# Altium schematic sheet Inputs and Relays.SchDoc
size A; DocumentNumber: 4; SheetNumber: 4; SheetTotal: 6
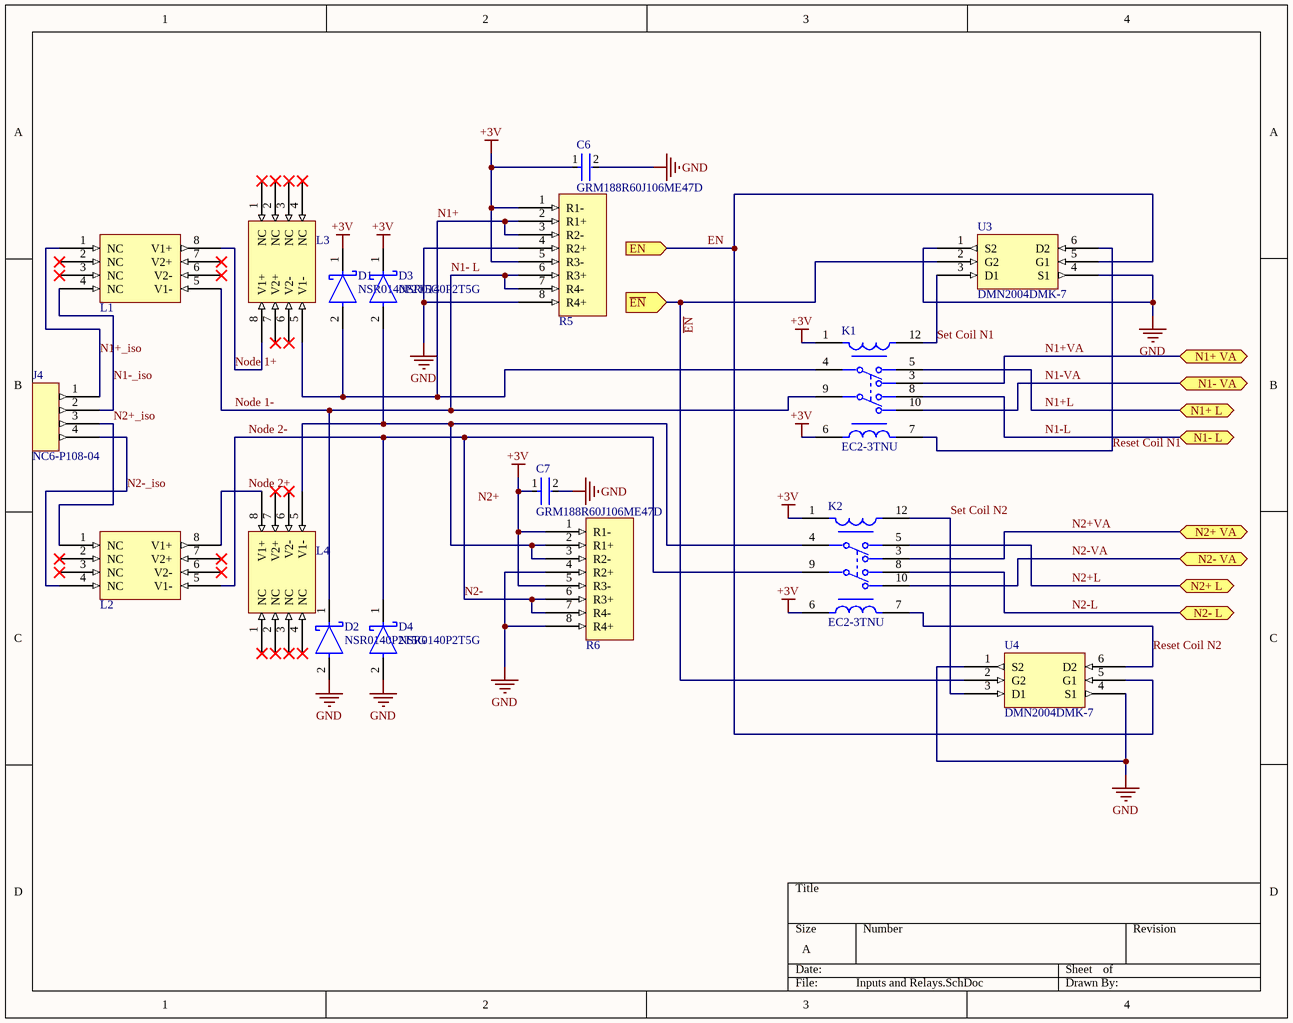
[diagram p0: Inputs and Relays.SchDoc]

## Parts
C6  GRM188R60J106ME47D  [FP-GRM188-0_1-e0_2_0_55-IPC_A]
C7  GRM188R60J106ME47D  [FP-GRM188-0_1-e0_2_0_55-IPC_A]
D1  NSR0140P2T5G  [FP-514AB-01-MFG]
D2  NSR0140P2T5G  [FP-514AB-01-MFG]
D3  NSR0140P2T5G  [FP-514AB-01-MFG]
D4  NSR0140P2T5G  [FP-514AB-01-MFG]
J4  NC6-P108-04  [NC6-P108-04-Footprint-1]
K1  EC2-3TNU  [FP-EC2-3TNU-MFG]
K2  EC2-3TNU  [FP-EC2-3TNU-MFG]
L1  RM6 Inductor  [RM6 Inductor-Footprint-1]  (value not drawn)
L2  RM6 Inductor  [RM6 Inductor-Footprint-1]  (value not drawn)
L3  RM6 Inductor  [RM6 Inductor-Footprint-1]  (value not drawn)
L4  RM6 Inductor  [RM6 Inductor-Footprint-1]  (value not drawn)
R5  4608X-102-205FLF  [4608X-102-205FLF-Footprint-1]  (value not drawn)
R6  4608X-102-205FLF  [4608X-102-205FLF-Footprint-1]  (value not drawn)
U3  DMN2004DMK-7  [SOT95P285X130-6N]
U4  DMN2004DMK-7  [SOT95P285X130-6N]

## Ports
EN (in), N1+ L (bidir), N1+ VA (bidir), N1- L (bidir), N1- VA (bidir), N2+ L (bidir), N2+ VA (bidir), N2- L (bidir), N2- VA (bidir), ~{EN} (in)

## Nets
+3V: C6.1 C7.1 D1.1(C) D3.1(C) K1.1(SET+) K1.6(RESET+) K2.1(SET+) K2.6(RESET+) R5.1(R1-) R5.5(R3-) R6.1(R1-) R6.5(R3-)
GND: C6.2 C7.2 D2.2(A) D4.2(A) R5.4(R2+) R5.8(R4+) R6.4(R2+) R6.8(R4+) U3.1(S2) U3.4(S1) U4.1(S2) U4.4(S1)
~{EN}: U3.2(G2) U4.2(G2) ; port ~{EN}
EN: U3.5(G1) U4.5(G1) ; port EN
N1+: D1.2(A) K1.4 L3.5(V1-) R5.2(R1+) R5.3(R2-)
N1+_iso: J4.1 L1.1(NC)
N1+L: K1.5 ; port N1+ L
N1+VA: K1.3 ; port N1+ VA
N1- L: D2.1(C) K1.9 L1.5(V1-) R5.6(R3+) R5.7(R4-)  [also labelled Node 1-]
N1-_iso: J4.2 L1.4(NC)
N1-L: K1.8 ; port N1- L
N1-VA: K1.10 ; port N1- VA
N2+_iso: J4.3 L2.1(NC)
N2+L: K2.5 ; port N2+ L
N2+VA: K2.3 ; port N2+ VA
N2-: D4.1(C) K2.9 L2.5(V1-) R6.6(R3+) R6.7(R4-)  [also labelled Node 2-]
N2-_iso: J4.4 L2.4(NC)
N2-L: K2.8 ; port N2- L
N2-VA: K2.10 ; port N2- VA
Node 1+: L1.8(V1+) L3.8(V1+)
Node 2+: L2.8(V1+) L4.8(V1+)
Reset Coil N1: K1.7(RESET-) U3.6(D2)
Reset Coil N2: K2.7(RESET-) U4.6(D2)
Set Coil N1: K1.12(SET-) U3.3(D1)
Set Coil N2: K2.12(SET-) U4.3(D1)
NetD3_2: D3.2(A) K2.4 L4.5(V1-) R6.2(R1+) R6.3(R2-)

Not connected (* = marked no-connect by the designer): L1 2(NC)* 3(NC)* 6(V2-)* 7(V2+)*; L2 2(NC)* 3(NC)* 6(V2-)* 7(V2+)*; L3 1(NC)* 2(NC)* 3(NC)* 4(NC)* 6(V2-)* 7(V2+)*; L4 1(NC)* 2(NC)* 3(NC)* 4(NC)* 6(V2-)* 7(V2+)*

## Notes on the sheet
- Labels drawn without touching a wire or pin: N2+

## Library data of the parts
C6 C7 = CMP-2006-02792-2: Chip Multilayer Ceramic Capacitors for General Purpose, 0603, 10uF, X5R, 15%, 20%, 6.3V; Packaging: Tape and Reel; Voltage Rating (DC): 6.3V; Width: 0.031inch; Termination: SMD/SMT; Dielectric: X5R; Package Quantity: 4000; Voltage Rating: 6.3V; Capacitance: 10uF; Case/Package: 0603; Min Operating Temperature: -55°C; Voltage: 6.3V; Length: 1.6mm; Thickness: 0.035inch; Lead Free: Lead Free; Depth: 0.8mm; Case Code (Imperial): 0603; Max Operating Temperature: 85°C; Material: Ceramic; Height: 0.8mm; Tolerance: 20%; Mount: Surface Mount; REACH SVHC: No SVHC; Radiation Hardening: No; Case Code (Metric): 1608
D1-D4 = CMP-1055-00493-2: DIODE SCHOTTKY 30V 70MA SOD923; Manufacturer: On Semiconductor; Max Surge Forward Current: 500mA; Capacitance: 2pF; Import Ts: 1521866362; Peak Reverse Current: 0.3uA; Ciiva Ids: 19354163; Max Repetitive Reverse Voltage: 40V; Max Junction Temp: +125°C; Value: 2pF; Automotive: No; ComponentLink2URL: http://www.onsemi.cn/pub_link/Collateral/NSR0140P2-D.PDF; Mouser Description: Schottky Diodes & Rectifiers SCHOTTKY DIODE; Height: 0.4mm; Temperature: -55°C to +125°C; Lead Free: Yes; Temperature Range Low: -55°C; Forward Current: 70mA; Device Class L2: Diodes; Reverse Voltage: 30V; Digikey Description: DIODE SCHOTTKY 30V 70MA SOD923; Temperature Range High: +125°C; Category: Diode; Octopart: https://octopart.com/nsr0140p2t5g-on+semiconductor-7506148; Device Class L1: Discrete Semiconductors; ComponentLink2Description: Datasheet; Package: 514AB-01; Device Class L3: Schottky Diodes; Release Date: 1407123163; Manufacturer Part Number: NSR0140P2T5G; RoHS: TRUE
J4 = CMP-002-00071-4: Conn Barrier Strip 4 POS 9.53mm Solder ST Thru-Hole 20A/Contact
K1 K2 = CMP-03195-000015-1: RELAY GEN PURPOSE DPDT 2A 3VDC; Relay Type: General Purpose; Release Time: 1ms; Number of Poles: 1; Power Consumption: 140mW; Coil Type: Latching, Dual Coil; Coil Resistance: 64.3R; Coil Voltage (DC): 3V; Coil Current: 46.7mA; Max Voltage Rating (AC): 250V; Max Voltage Rating (DC): 220V; Operate Time: 2ms; Throw Configuration: DPDT; Current Rating: 2A; Depth: 7.5mm; Contact Current Rating: 2A; Height: 9.4mm; Package Quantity: 35; Number of Pins: 10; Coil Power: 140mW; RoHS Compliant: Yes; Mount: Through Hole; Max Current Rating: 2A; Max Operating Temperature: 85°C; Contact Material: Gold; Radiation Hardening: No; Termination: PC Pin; Min Operating Temperature: -40°C; Length: 15mm; Packaging: Rail/Tube
L1-L4 = CMP-006-00021-1
R5 R6 = CMP-009-00178-1: Res Thick Film NET 2M Ohm 1% 1W ±100ppm/C ISOL Conformal Coated 8-Pin SIP Pin Thru-Hole Bulk
U3 U4 = CMP-013-00035-1: Transistor MOSFET Array Dual N-CH 20V 540mA 6-Pin SOT-26 T/R